# EAGLE design MKV30F128VFL10PmaximumV2 (EAGLE 6.1)
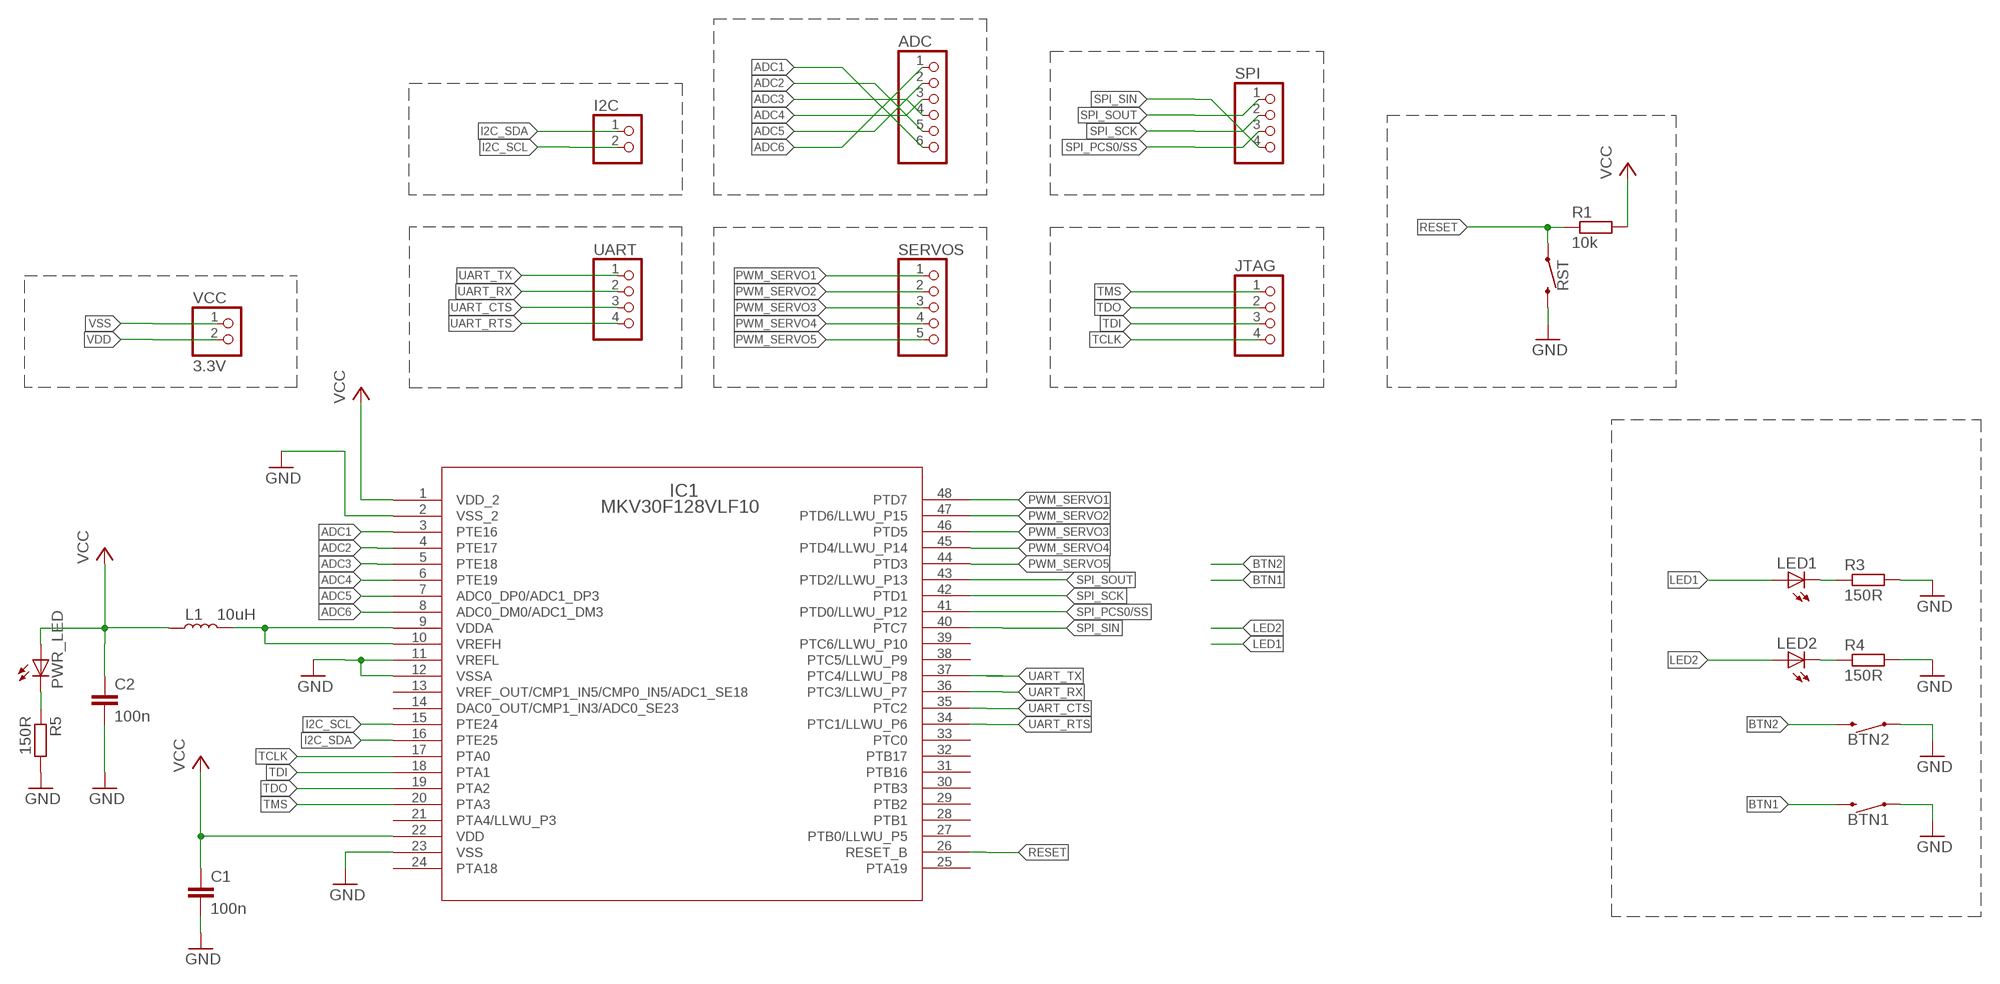
[diagram p0: schematic, sheet 1]

## Parts
ADC  PINHD-1X6/90  [1X06/90]
BTN1  MOMENTARY-SWITCH-SPST-SMD-6.0X3.5MM  [TACTILE_SWITCH_SMD_6.0X3.5MM]
BTN2  MOMENTARY-SWITCH-SPST-SMD-6.0X3.5MM  [TACTILE_SWITCH_SMD_6.0X3.5MM]
C1  100n  C-EUC0805  [C0805]
C2  100n  C-EUC0805  [C0805]
I2C  PINHD-1X2/90  [1X02/90]
IC1  MKV30F128VLF10  [LQFP-48_7X7X1.6]
JTAG  PINHD-1X4/90  [1X04/90]
L1  10uH  INDUCTOR-0805-3.3UH  [0805]
LED1  LEDCHIP-LED0805  [CHIP-LED0805]
LED2  LEDCHIP-LED0805  [CHIP-LED0805]
PWR_LED  LEDCHIP-LED0805  [CHIP-LED0805]
R1  10k  R-EU_R0805W  [R0805W]
R3  150R  R-EU_R0805W  [R0805W]
R4  150R  R-EU_R0805W  [R0805W]
R5  150R  R-EU_R0805W  [R0805W]
RST  MOMENTARY-SWITCH-SPST-SMD-6.0X3.5MM  [TACTILE_SWITCH_SMD_6.0X3.5MM]
SERVOS  PINHD-1X5/90  [1X05/90]
SPI  PINHD-1X4/90  [1X04/90]
UART  PINHD-1X4/90  [1X04/90]
VCC  3.3V  PINHD-1X2/90  [1X02/90]

## Nets
ADC1: ADC.6 IC1.3(PTE16)
ADC2: ADC.5 IC1.4(PTE17)
ADC3: ADC.4 IC1.5(PTE18)
ADC4: ADC.3 IC1.6(PTE19)
ADC5: ADC.2 IC1.7(ADC0_DP0/ADC1_DP3)
ADC6: ADC.1 IC1.8(ADC0_DM0/ADC1_DM3)
BTN1: BTN1.2
BTN2: BTN2.2
I2C_SCL: I2C.2 IC1.15(PTE24)
I2C_SDA: I2C.1 IC1.16(PTE25)
LED1: LED1.A
LED2: LED2.A
N$5: LED2.C R4.1
N$6: LED1.C R3.1
N$7: PWR_LED.C R5.1
PWM_SERVO1: IC1.48(PTD7) SERVOS.1
PWM_SERVO2: IC1.47(PTD6/LLWU_P15) SERVOS.2
PWM_SERVO3: IC1.46(PTD5) SERVOS.3
PWM_SERVO4: IC1.45(PTD4/LLWU_P14) SERVOS.4
PWM_SERVO5: IC1.44(PTD3) SERVOS.5
RESET: IC1.26(RESET_B) R1.1 RST.1
SPI_PCS0/SS: IC1.41(PTD0/LLWU_P12) SPI.3
SPI_SCK: IC1.42(PTD1) SPI.2
SPI_SIN: IC1.40(PTC7) SPI.4
SPI_SOUT: IC1.43(PTD2/LLWU_P13) SPI.1
TCLK: IC1.17(PTA0) JTAG.4
TDI: IC1.18(PTA1) JTAG.3
TDO: IC1.19(PTA2) JTAG.2
TMS: IC1.20(PTA3) JTAG.1
UART_CTS: IC1.35(PTC2) UART.3
UART_RTS: IC1.34(PTC1/LLWU_P6) UART.4
UART_RX: IC1.36(PTC3/LLWU_P7) UART.2
UART_TX: IC1.37(PTC4/LLWU_P8) UART.1
VDD: C1.1 C2.1 IC1.1(VDD_2) IC1.22(VDD) L1.1 PWR_LED.A R1.2 VCC.2 ; supply symbol labelled VCC
VDDA: IC1.9(VDDA) IC1.10(VREFH) L1.2
VSS: BTN1.1 BTN2.1 C1.2 C2.2 IC1.2(VSS_2) IC1.11(VREFL) IC1.12(VSSA) IC1.23(VSS) R3.2 R4.2 R5.2 RST.2 VCC.1 ; supply symbol labelled GND
Unconnected: IC1.13(VREF_OUT/CMP1_IN5/CMP0_IN5/ADC1_SE18) IC1.14(DAC0_OUT/CMP1_IN3/ADC0_SE23) IC1.21(PTA4/LLWU_P3) IC1.24(PTA18) IC1.25(PTA19) IC1.27(PTB0/LLWU_P5) IC1.28(PTB1) IC1.29(PTB2) IC1.30(PTB3) IC1.31(PTB16) IC1.32(PTB17) IC1.33(PTC0) IC1.38(PTC5/LLWU_P9) IC1.39(PTC6/LLWU_P10)

## Library data of the parts
ADC = pinhead:PINHD-1X6: PIN HEADER
BTN1 BTN2 RST = SparkFun-Switches:MOMENTARY-SWITCH-SPST: Momentary Switch (Pushbutton) - SPST Normally-open (NO) SPST momentary switches (buttons, pushbuttons). Variants PTH-12MM - 12mm square, through-hole Momentary Pushbutton Switch - 12mm Square <https://www.sparkfun.com/products/9190> (COM-09190) PTH-6.0MM, PTH-6.0MM-KIT - 6.0mm square, through-hole Mini Pushbutton Switch <https://www.sparkfun.com/products/97> (COM-00097) KIT package intended for soldering kit's - only one side of pads' copper is exposed. PTH-RIGHT-ANGLE-KIT - Right-angle, through-hole Right Angle Tactile Button <https://www.sparkfun.com/products/10791> - Used on SparkFun BigTime Watch Kit <https://www.sparkfun.com/products/11734> SMD-12MM - 12mm square, surface-mount Tactile Button - SMD (12mm) <https://www.sparkfun.com/products/12993> (COM-12993) Used on SparkFun PicoBoard <https://www.sparkfun.com/products/11888> SMD-4.5MM - 4.5mm Square Trackball Switch Used on SparkFun Blackberry Trackballer Breakout <https://www.sparkfun.com/products/13169> SMD-4.6MMX2.8MM - 4.60mm x 2.80mm, surface mount Used on SparkFun SAMD21 Mini Breakout <https://www.sparkfun.com/products/13664> SMD-5.2MM, SMD-5.2-REDUNDANT - 5.2mm square, surface-mount Mini Pushbutton Switch - SMD <https://www.sparkfun.com/products/8720> (COM-08720) Used on Arduino Pro Mini <https://www.sparkfun.com/products/11114> REDUNDANT package connects both switch circuits together SMD-6.0X3.5MM - 6.0 x 3.5mm, surface mount Momentary Reset Switch SMD <https://www.sparkfun.com/products/8229> (COM-08229) SMD-6.2MM-TALL - 6.2mm square, surface mount Tactile Button - SMD (6mm) <https://www.sparkfun.com/products/12992> Used on SparkFun Digital Sandbox <https://www.sparkfun.com/products/12651> SMD-RIGHT-ANGLE - Right-angle, surface mount Used on SparkFun Block for Intel® Edison - Arduino <https://www.sparkfun.com/products/13036>; PROD_ID: SWCH-00815; SF_SKU: COM-08229
C1 C2 = resistor:C-EU: CAPACITOR, European symbol
I2C VCC = pinhead:PINHD-1X2: PIN HEADER
IC1 = MKV30F128Vxx10P:MKV30F128VLF10; CPU: ARM Cortex-M4F; FLASHKB: 128; MANUFACTURER_PART_NUMBER: mkv30f128vlf10; MAXFREQUENCY: 100; PINCOUNT: 48; SRAMKB: 16; VENDOR: FREESCALE
JTAG SPI UART = pinhead:PINHD-1X4: PIN HEADER
L1 = SparkFun-Coils:INDUCTOR: Inductors Resist changes in electrical current. Basically a coil of wire. SparkFun Products: SparkFun Load Cell Amplifier - HX711 <https://www.sparkfun.com/products/13879> IOIO-OTG - V2.2 <https://www.sparkfun.com/products/13613>; PROD_ID: NDUC-13076; VALUE: 3.3µH/±20%/450mA
LED1 LED2 PWR_LED = led:LED: LED OSRAM: - CHIPLED LG R971, LG N971, LY N971, LG Q971, LY Q971, LO R971, LY R971 LH N974, LH R974 LS Q976, LO Q976, LY Q976 LO Q996 - Hyper CHIPLED LW Q18S LB Q993, LB Q99A, LB R99A - SideLED LS A670, LO A670, LY A670, LG A670, LP A670 LB A673, LV A673, LT A673, LW A673 LH A674 LY A675 LS A676, LA A676, LO A676, LY A676, LW A676 LS A679, LY A679, LG A679 - Hyper Micro SIDELED® LS Y876, LA Y876, LO Y876, LY Y876 LT Y87S - SmartLED LW L88C, LW L88S LB L89C, LB L89S, LG L890 LS L89K, LO L89K, LY L89K LS L896, LA L896, LO L896, LY L896 - TOPLED LS T670, LO T670, LY T670, LG T670, LP T670 LSG T670, LSP T670, LSY T670, LOP T670, LYG T670 LG T671, LOG T671, LSG T671 LB T673, LV T673, LT T673, LW T673 LH T674 LS T676, LA T676, LO T676, LY T676, LB T676, LH T676, LSB T676, LW T676 LB T67C, LV T67C, LT T67C, LS T67K, LO T67K, LY T67K, LW E67C LS E67B, LA E67B, LO E67B, LY E67B, LB E67C, LV E67C, LT E67C LW T67C LS T679, LY T679, LG T679 LS T770, LO T770, LY T770, LG T770, LP T770 LB T773, LV T773, LT T773, LW T773 LH T774 LS E675, LA E675, LY E675, LS T675 LS T776, LA T776, LO T776, LY T776, LB T776 LHGB T686 LT T68C, LB T68C - Hyper Mini TOPLED® LB M676 - Mini TOPLED Santana® LG M470 LS M47K, LO M47K, LY M47K Source: http://www.osram.convergy.de LUXEON: - LUMILED® LXK2-PW12-R00, LXK2-PW12-S00, LXK2-PW14-U00, LXK2-PW14-V00 LXK2-PM12-R00, LXK2-PM12-S00, LXK2-PM14-U00 LXK2-PE12-Q00, LXK2-PE12-R00, LXK2-PE12-S00, LXK2-PE14-T00, LXK2-PE14-U00 LXK2-PB12-K00, LXK2-PB12-L00, LXK2-PB12-M00, LXK2-PB14-N00, LXK2-PB14-P00, LXK2-PB14-Q00 LXK2-PR12-L00, LXK2-PR12-M00, LXK2-PR14-Q00, LXK2-PR14-R00 LXK2-PD12-Q00, LXK2-PD12-R00, LXK2-PD12-S00 LXK2-PH12-R00, LXK2-PH12-S00 LXK2-PL12-P00, LXK2-PL12-Q00, LXK2-PL12-R00 Source: www.luxeon.com KINGBRIGHT: KA-3528ASYC Source: www.kingbright.com
R1 R3-R5 = rcl:R-EU_: RESISTOR, European symbol
SERVOS = pinhead:PINHD-1X5: PIN HEADER

## Board
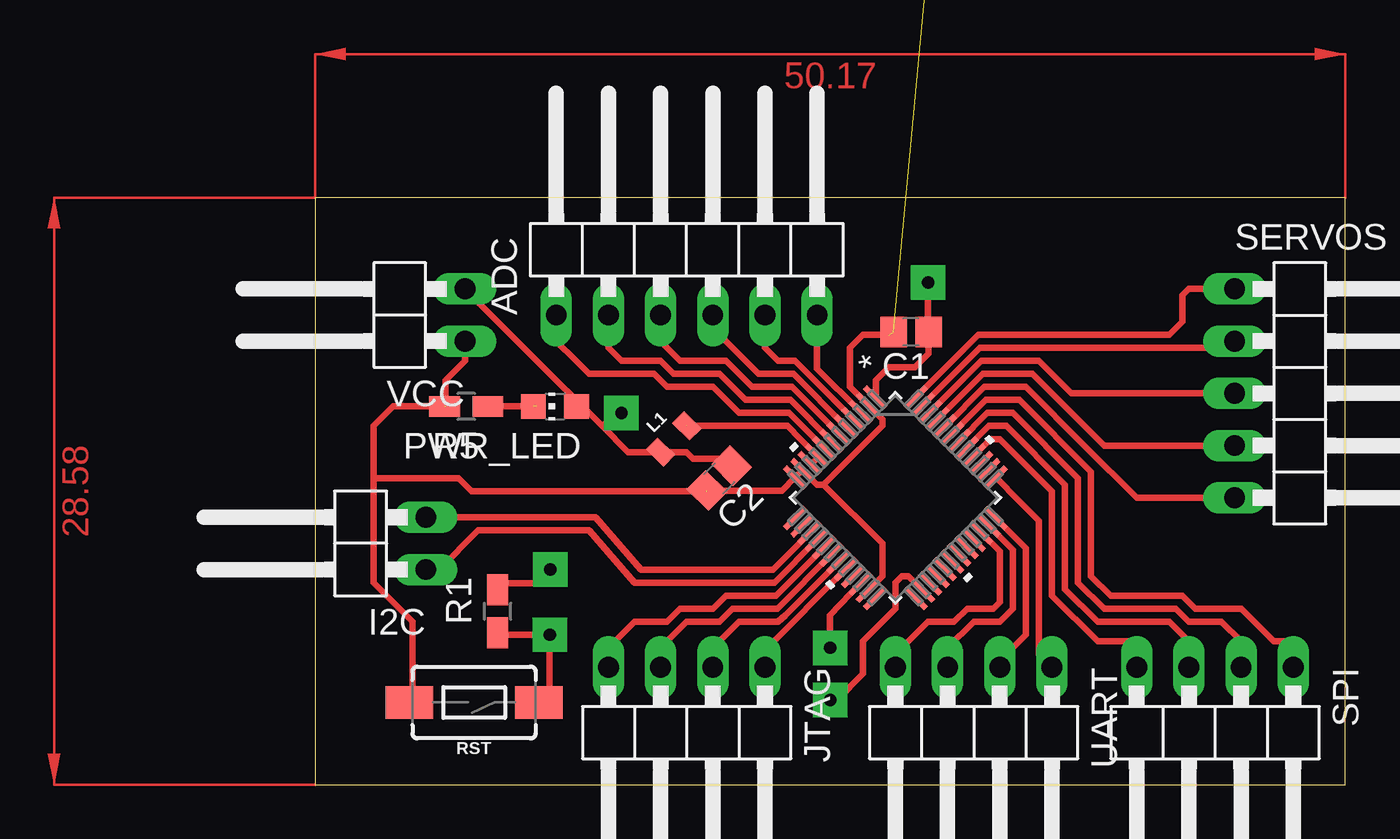
[diagram p1: board, top side]
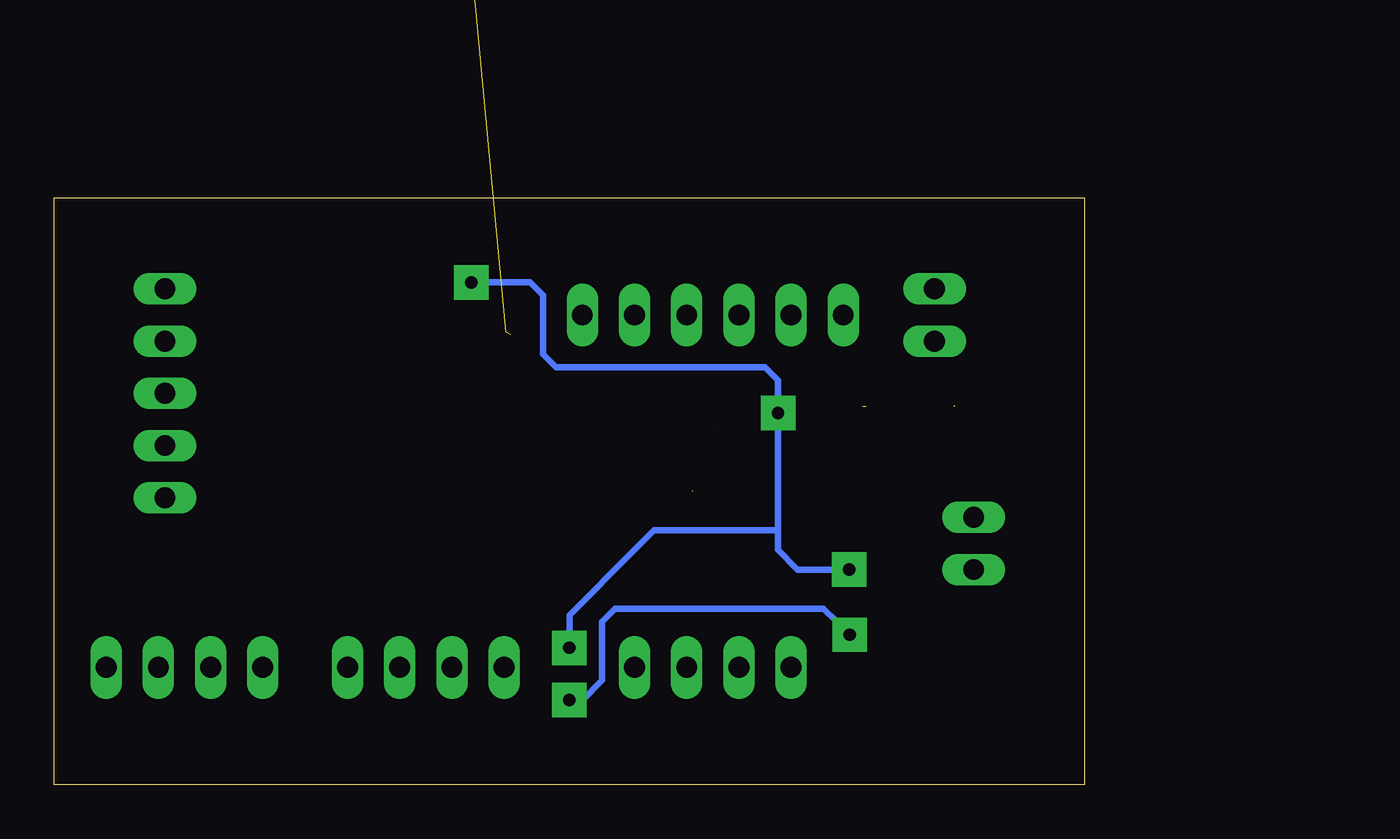
[diagram p2: board, bottom side, seen from below]

Size 50.17 x 28.58 mm. Coordinates in mm from the lower left corner, seen from the top.
Outline: 0,0 50.17,0 50.17,28.58 0,28.58 0,0
Copper layers (1*16): Top 0.035mm / dielectric 1.5mm / Bottom 0.035mm
Design rules: minimum track width 10mil, minimum drill 24mil, track to track 8mil, track to pad 8mil, pad to pad 8mil, via to via 8mil, smd to smd 8mil, copper to edge 40mil, drill to drill 8mil, minimum pad ring 10mil, minimum via ring 8mil, stop-mask expansion 4mil, vias tented up to drill 0mil, thermal gap 10mil

### Footprints (pad centres in the part's own frame; a part is rotated, then mirrored left to right if it is on the bottom)
1X06/90 = drill 1.016 long: 1 -6.35,-3.81; 2 -3.81,-3.81; 3 -1.27,-3.81; 4 1.27,-3.81; 5 3.81,-3.81; 6 6.35,-3.81
TACTILE_SWITCH_SMD_6.0X3.5MM = smd 2.3 x 1.6: 1 -3.15,0; 2 3.15,0
C0805 = smd 1.3 x 1.5: 1 -0.85,0; 2 0.85,0
1X02/90 = drill 1.016 long: 1 -1.27,-3.81; 2 1.27,-3.81
LQFP-48_7X7X1.6 = smd 1.411 x 0.27: 1 -4.15,2.75; 2 -4.15,2.25; 3 -4.15,1.75; 4 -4.15,1.25; 5 -4.15,0.75; 6 -4.15,0.25; 7 -4.15,-0.25; 8 -4.15,-0.75; 9 -4.15,-1.25; 10 -4.15,-1.75; 11 -4.15,-2.25; 12 -4.15,-2.75; 25 4.15,-2.75; 26 4.15,-2.25; 27 4.15,-1.75; 28 4.15,-1.25; 29 4.15,-0.75; 30 4.15,-0.25; 31 4.15,0.25; 32 4.15,0.75; 33 4.15,1.25; 34 4.15,1.75; 35 4.15,2.25; 36 4.15,2.75 | smd 0.27 x 1.411: 13 -2.75,-4.15; 14 -2.25,-4.15; 15 -1.75,-4.15; 16 -1.25,-4.15; 17 -0.75,-4.15; 18 -0.25,-4.15; 19 0.25,-4.15; 20 0.75,-4.15; 21 1.25,-4.15; 22 1.75,-4.15; 23 2.25,-4.15; 24 2.75,-4.15; 37 2.75,4.15; 38 2.25,4.15; 39 1.75,4.15; 40 1.25,4.15; 41 0.75,4.15; 42 0.25,4.15; 43 -0.25,4.15; 44 -0.75,4.15; 45 -1.25,4.15; 46 -1.75,4.15; 47 -2.25,4.15; 48 -2.75,4.15
1X04/90 = drill 1.016 long: 1 -3.81,-3.81; 2 -1.27,-3.81; 3 1.27,-3.81; 4 3.81,-3.81
0805 = smd 0.8 x 1.2: 1 -0.9,0; 2 0.9,0
CHIP-LED0805 = smd 1.2 x 1.2: A 0,-1.05; C 0,1.05
R0805W = smd 1.5 x 1: 1 -1.052,0; 2 1.052,0
1X05/90 = drill 1.016 long: 1 -5.08,-3.81; 2 -2.54,-3.81; 3 0,-3.81; 4 2.54,-3.81; 5 5.08,-3.81

### Placement (x,y rotation side)
ADC  18.1,26.67 0 top
BTN1  35.75,44.45 270 top  (outside the outline)
BTN2  30.54,44.45 270 top  (outside the outline)
C1  29.02,22.03 180 top
C2  19.69,14.92 225 top
I2C  1.59,11.75 90 top
IC1  28.26,13.97 315 top
JTAG  18.1,1.9 180 top
L1  17.46,16.83 45 top
LED1  45.53,41.91 0 top  (outside the outline)
LED2  41.08,41.91 0 top  (outside the outline)
PWR_LED  11.68,18.41 90 top
R1  8.89,8.45 90 top
R3  45.53,46.61 90 top  (outside the outline)
R4  41.08,46.61 90 top  (outside the outline)
R5  7.37,18.41 180 top
RST  7.74,4.01 180 top
SERVOS  48.58,19.05 270 top
SPI  43.81,1.9 180 top
UART  32.07,1.9 180 top
VCC  3.49,22.86 90 top

### Tracks (layer width: path | path; a pad name or v marks a point on that pad's centre or on a via)
ADC1
  Top 0.305: IC1.3 24.45,20.25 ADC.6
ADC2
  Top 0.305: IC1.4 23.36,20.64 22.86,20.64 22.54,20.64 21.91,21.27 ADC.5
ADC3
  Top 0.305: IC1.5 23.29,20 23.18,20 21.59,20 19.37,22.22 ADC.4
ADC4
  Top 0.305: IC1.6 23.21,19.37 21.91,19.37 21.27,19.37 20,20.64 18.1,20.64 17.78,20.64 16.83,21.59 ADC.3
ADC5
  Top 0.305: IC1.7 23.14,18.73 22.54,18.73 20.96,18.73 19.68,20 17.46,20 16.83,20.64 15.24,20.64 14.92,20.64 14.29,21.27 ADC.2
ADC6
  Top 0.305: IC1.8 23.07,18.1 22.23,18.1 20.64,18.1 19.37,19.37 17.15,19.37 16.51,20 13.33,20 12.7,20.64 11.75,21.59 ADC.1
I2C_SCL
  Top 0.305: IC1.15 22.29,10.48 20.64,10.48 15.87,10.48 13.65,13.02 I2C.2
I2C_SDA
  Top 0.305: IC1.16 22.36,9.84 22.23,9.84 15.56,9.84 13.33,12.38 7.94,12.38 6.03,10.48 I2C.1
N$5  (1 unrouted)
N$6  (1 unrouted)
N$7  (1 unrouted)
  Top 0.305: R5.1 10.79,18.41
PWM_SERVO1
  Top 0.305: IC1.48 32.31,21.91 41.59,21.91 42.23,22.54 42.23,23.81 42.54,24.13 43.18,24.13 44.45,24.13 SERVOS.1
PWM_SERVO2
  Top 0.305: IC1.47 32.38,21.27 43.5,21.27 SERVOS.2
PWM_SERVO3
  Top 0.305: IC1.46 32.45,20.64 35.24,20.64 36.83,19.05 SERVOS.3
PWM_SERVO4
  Top 0.305: IC1.45 32.52,20 33.02,20 34.92,20 38.42,16.51 39.05,16.51 SERVOS.4
PWM_SERVO5
  Top 0.305: IC1.44 32.59,19.37 33.02,19.37 34.61,19.37 37.47,16.51 40.01,13.97 SERVOS.5
RESET  (via drill 0.6 pad 1.68)
  Top 0.305: IC1.26 28.89,10.15 28.89,10.16 28.58,10.16 28.26,9.84 28.26,8.57 26.67,6.98 26.67,5.4 25.4,4.13 v25.08,4.13 | RST.1 11.43,4.54 v11.43,7.3 9.18,7.3 R1.1
  Bottom 0.305: v11.43,7.3 12.07,7.94 12.7,8.57 22.86,8.57 23.5,7.94 23.5,5.08 24.45,4.13 v25.08,4.13
SPI_PCS0/SS
  Top 0.305: IC1.41 32.81,17.46 33.65,17.46 36.51,14.6 36.51,9.52 38.1,7.94 41.59,7.94 42.54,6.98 SPI.3
SPI_SCK
  Top 0.305: IC1.42 32.74,18.1 33.97,18.1 37.15,14.92 37.15,11.43 37.15,9.84 38.42,8.57 41.91,8.57 42.54,7.94 44.13,7.94 45.09,6.98 SPI.2
SPI_SIN
  Top 0.305: IC1.40 32.88,16.83 33.34,16.83 35.88,14.29 35.88,9.21 38.1,6.98 39.69,6.98 40.01,6.67 SPI.4
SPI_SOUT
  Top 0.305: IC1.43 32.67,18.73 32.7,18.73 34.29,18.73 37.78,15.24 37.78,10.16 38.73,9.21 42.23,9.21 42.86,8.57 45.09,8.57 46.67,6.98 47.62,6.98 SPI.1
TCLK
  Top 0.305: IC1.17 22.43,9.21 22.23,9.21 20,9.21 19.37,8.57 17.78,8.57 17.15,7.94 15.56,7.94 14.29,6.67 JTAG.4
TDI
  Top 0.305: IC1.18 22.51,8.57 21.59,8.57 20.32,8.57 19.68,7.94 18.1,7.94 16.83,6.67 JTAG.3
TDO
  Top 0.305: IC1.19 22.9,8.25 22.54,7.94 20.64,7.94 19.37,6.67 JTAG.2
TMS
  Top 0.305: IC1.20 21.91,6.56 JTAG.1
UART_CTS
  Top 0.305: IC1.35 33.97,11.44 33.97,11.11 33.97,10.16 33.97,8.57 33.34,7.94 32.07,7.94 30.8,6.67 UART.3
UART_RTS
  Top 0.305: IC1.34 33.34,11.36 33.34,11.11 33.34,8.89 33.02,8.57 31.75,8.57 31.12,7.94 30.16,7.94 29.84,7.94 28.26,6.35 UART.4
UART_RX
  Top 0.305: IC1.36 34.61,11.51 34.61,10.79 34.61,7.3 33.34,6.03 UART.2
UART_TX
  Top 0.305: IC1.37 34.29,13.81 35.24,12.85 35.24,12.38 35.24,6.35 UART.1
VDD  (via drill 0.6 pad 1.68)
  Top 0.305: IC1.1 27.31,18.89 27.31,19.69 27.94,20.32 28.26,20.32 29.21,20.32 29.87,20.98 C1.1 29.84,22.06 v29.84,24.45 | VCC.2 8.25,23.18 8.57,22.86 10.48,20.95 11.11,20.32 11.75,19.69 12.7,18.73 | 13.97,17.46 13.02,18.41 12.7,18.73 | 13.97,17.46 15.24,16.19 L1.1 | L1.1 16.76,16.26 L1.1 | L1.1 17.78,16.19 18.1,16.19 18.42,15.88 20,15.88 20.29,15.59 C2.1 | 13.97,17.46 v14.92,18.1 | R1.2 9.21,9.82 10.77,9.82 10.79,9.84 v11.46,10.48 | PWR_LED.A 12.7,18.45 12.7,18.73 | IC1.22 25.08,8.25 v25.08,6.67
  Bottom 0.305: v29.84,24.45 26.99,24.45 26.35,23.81 26.35,20.95 25.72,20.32 15.56,20.32 14.92,19.69 14.92,18.73 v14.92,18.1 14.92,12.38 | v11.46,10.48 13.97,10.48 14.92,11.43 14.92,12.38 | v25.08,6.67 25.08,8.25 21.91,11.43 20.96,12.38 17.15,12.38 14.92,12.38
VDDA  (1 unrouted)
  Top 0.305: IC1.10 24.24,15.67 24.45,15.88 24.44,15.88 IC1.9 23.63,16.83 23,17.46 L1.2
VSS  (7 unrouted)
  Top 0.305: 27.94,21.91 26.67,21.91 26.03,21.27 26.03,20.32 26.03,19.37 IC1.2 27.62,17.79 27.62,17.78 27.62,17.46 24.76,14.6 | 24.76,14.6 24.45,14.6 23.74,15.31 IC1.11 IC1.12 22.74,14.32 C2.2 | 19.05,14.29 16.83,14.29 16.19,14.29 13.33,14.29 7.62,14.29 6.98,14.92 2.86,14.92 | 24.76,14.6 27.62,11.75 27.62,10.16 27.62,10.15 IC1.23 | RST.2 4.76,4.17 4.76,7.94 2.86,9.84 2.86,14.92 | 2.86,14.92 2.86,16.51 | 2.86,16.51 2.86,17.46 3.81,18.41 6.35,18.41 6.35,19.69 7.3,20.64 VCC.1 | 2.86,14.92 2.86,16.51
(copper drawn outside any net)
  shapes: Top area x2